# Altium schematic sheet SCH9_BBB_Eth.SchDoc: Beaglebone Black - Ethernet
size B; Organization: CWRUbotix; Address1: 10900 Euclid Avenue; Address2: Cleveland, OH 44106; Address3: USA; Revision: 1.0; SheetNumber: 9; SheetTotal: 13
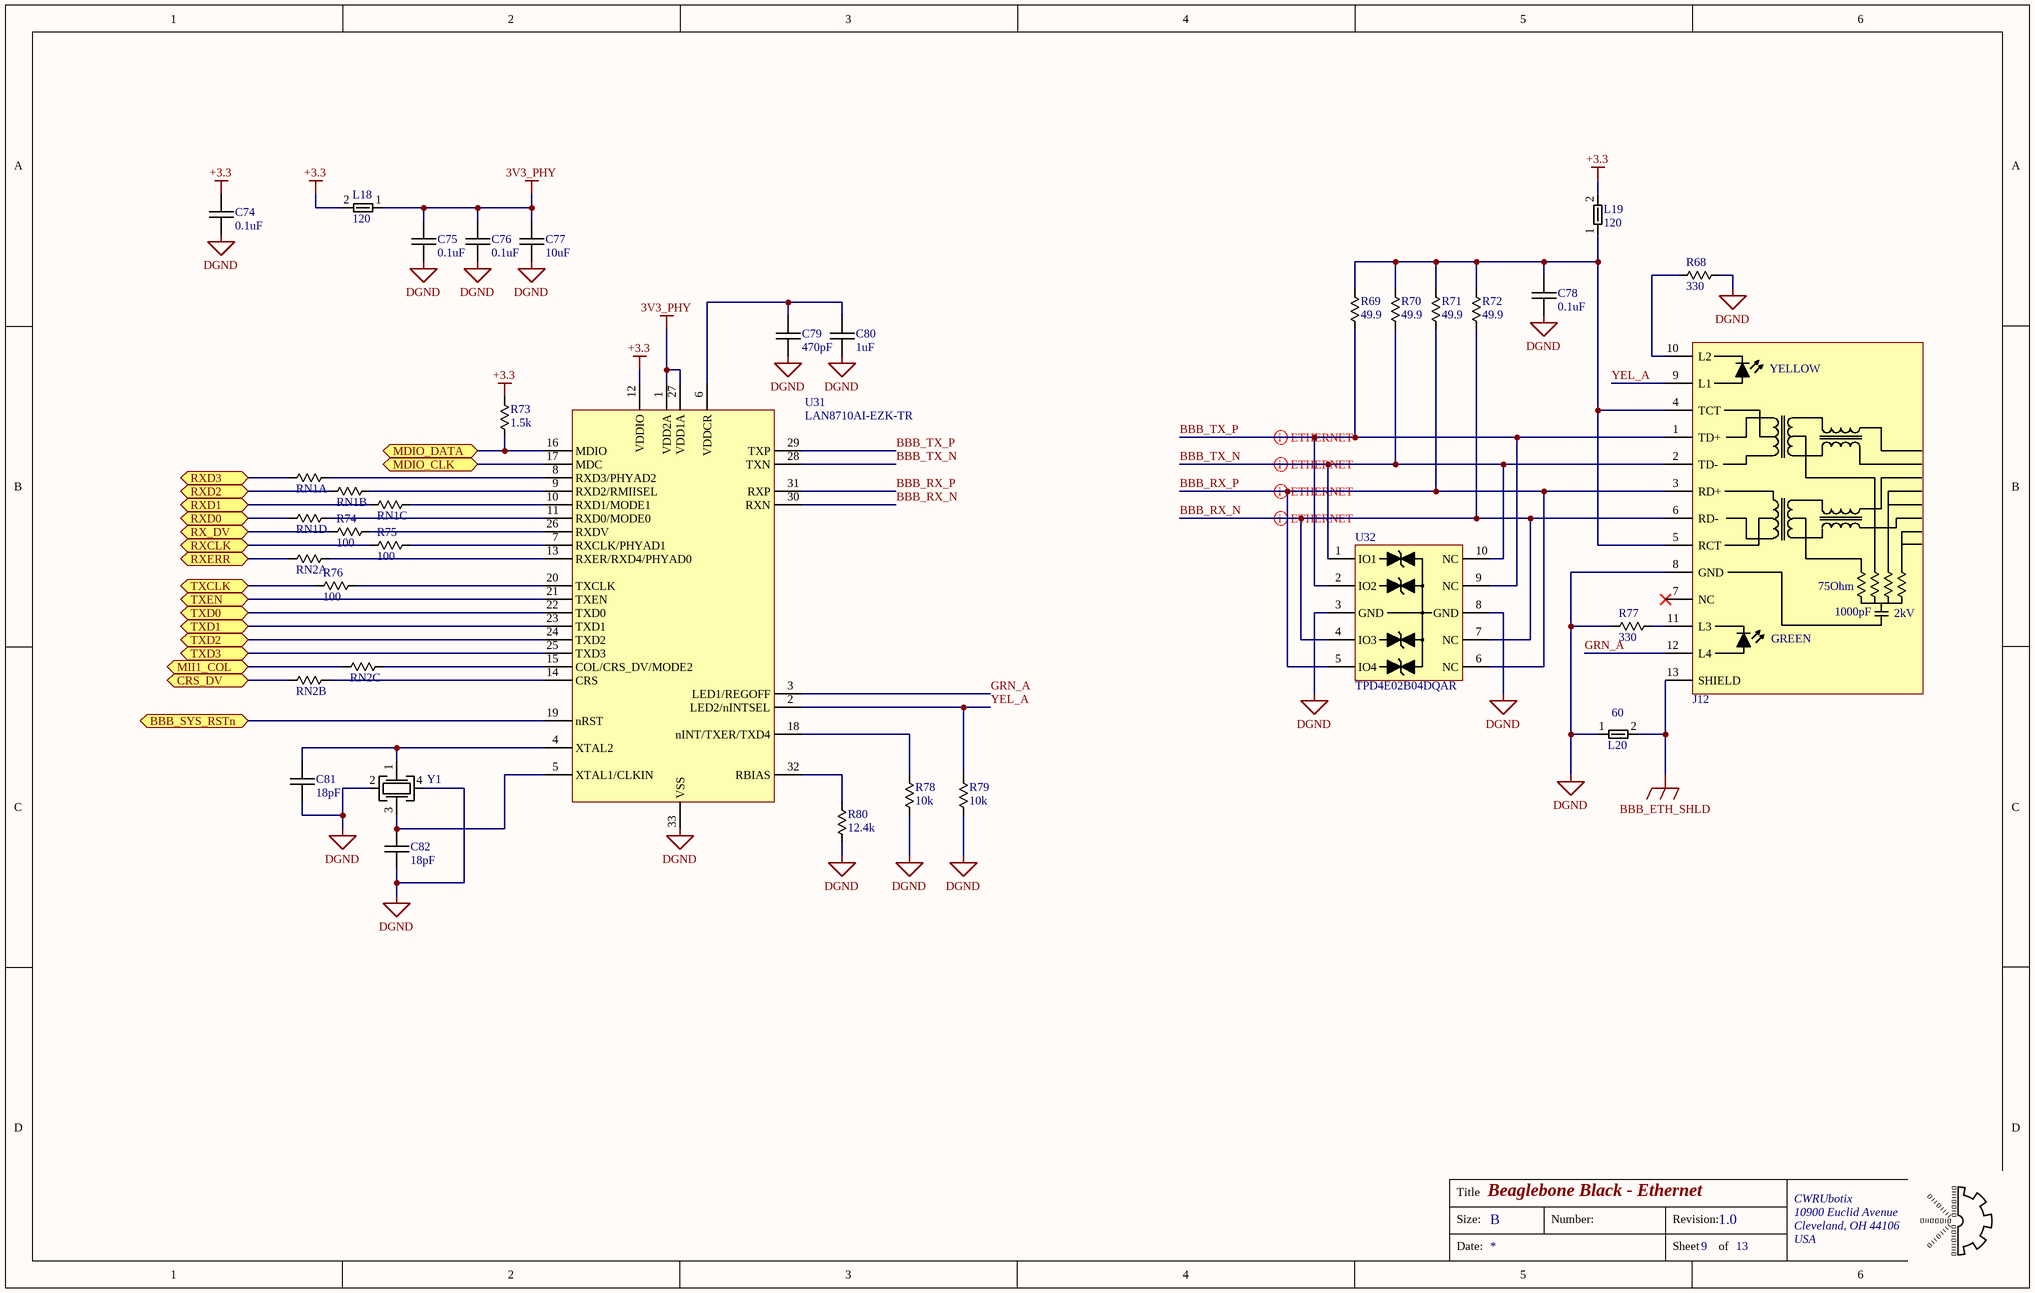
[diagram p0: SCH9_BBB_Eth.SchDoc]

## Parts
C74  0.1uF  [chip_0603]
C75  0.1uF  [chip_0603]
C76  0.1uF  [chip_0603]
C77  10uF  [chip_1206]
C78  0.1uF  [chip_0603]
C79  470pF  [chip_0603]
C80  1uF  [chip_0805]
C81  18pF  [chip_0603]
C82  18pF  [chip_0603]
J12  amphenol-RJMG1B  [AMPHENOL_RJMG1B]  (value not drawn)
L18  Impedance: 120  [CHIP_0603_FE]  (hidden comment: bead_0)
L19  Impedance: 120  [CHIP_0603_FE]  (hidden comment: bead_0)
L20  Impedance: 60  [CHIP_0805_FE]  (hidden comment: bead_0)
R68  330  [chip_0603]
R69  49.9  [chip_0603]
R70  49.9  [chip_0603]
R71  49.9  [chip_0603]
R72  49.9  [chip_0603]
R73  1.5k  [chip_0603]
R74  100  [chip_0603]
R75  100  [chip_0603]
R76  100  [chip_0603]
R77  330  [chip_0603]
R78  10k  [chip_0603]
R79  10k  [chip_0603]
R80  12.4k  [chip_0603]
RN1  res_array_4  [chip_1206_arr]  (value not drawn)  (parts A,B,C,D of 4)
RN2  res_array_4  [chip_1206_arr]  (value not drawn)  (parts A,B,C of 4)
U31  LAN8710AI-EZK-TR  [QFN-32-EP]
U32  TPD4E02B04DQAR  [USON-10]
Y1  osc_xtal_4p_1-3  [ECX-32]  (value not drawn)

## Ports
BBB_SYS_RSTn (bidir), CRS_DV (bidir), MDIO_CLK (bidir), MDIO_DATA (bidir), MII1_COL (bidir), RX_DV (bidir), RXCLK (bidir), RXD0 (bidir), RXD1 (bidir), RXD2 (bidir), RXD3 (bidir), RXERR (bidir), TXCLK (bidir), TXD0 (bidir), TXD1 (bidir), TXD2 (bidir), TXD3 (bidir), TXEN (bidir)

## Nets
3V3_PHY: C75.2 C76.2 C77.1 L18.1 U31.1(VDD2A) U31.27(VDD1A)
+3.3: C74.2 L18.2 L19.2 R73.1 U31.12(VDDIO)
BBB_ETH_SHLD: J12.13(SHIELD) L20.2
DGND: C74.1 C75.1 C76.1 C77.2 C78.1 C79.2 C80.2 C81.2 C82.2 J12.8(GND) L20.1 R68.1 R77.2 R78.2 R79.2 R80.2 U31.33(VSS) U32.3(GND) U32.8(GND) Y1.2(GND) Y1.4(GND)
BBB_RX_N: J12.6(RD-) R72.2 U31.30(RXN) U32.4(IO3) U32.7(NC)
BBB_RX_P: J12.3(RD+) R71.2 U31.31(RXP) U32.5(IO4) U32.6(NC)
BBB_SYS_RSTn: U31.19(nRST) ; port BBB_SYS_RSTn
BBB_TX_N: J12.2(TD-) R70.2 U31.28(TXN) U32.1(IO1) U32.10(NC)
BBB_TX_P: J12.1(TD+) R69.2 U31.29(TXP) U32.2(IO2) U32.9(NC)
CRS_DV: RN2.2 ; port CRS_DV
GRN_A: J12.12(L4) U31.3(LED1/REGOFF)
MDIO_CLK: U31.17(MDC) ; port MDIO_CLK
MDIO_DATA: R73.2 U31.16(MDIO) ; port MDIO_DATA
MII1_COL: RN2.3 ; port MII1_COL
RX_DV: R74.1 ; port RX_DV
RXCLK: R75.1 ; port RXCLK
RXD0: RN1.4 ; port RXD0
RXD1: RN1.3 ; port RXD1
RXD2: RN1.2 ; port RXD2
RXD3: RN1.1 ; port RXD3
RXERR: RN2.1 ; port RXERR
TXCLK: R76.1 ; port TXCLK
TXD0: U31.22(TXD0) ; port TXD0
TXD1: U31.23(TXD1) ; port TXD1
TXD2: U31.24(TXD2) ; port TXD2
TXD3: U31.25(TXD3) ; port TXD3
TXEN: U31.21(TXEN) ; port TXEN
YEL_A: J12.9(L1) R79.1 U31.2(LED2/nINTSEL)
NetC78_2: C78.2 J12.4(TCT) J12.5(RCT) L19.1 R69.1 R70.1 R71.1 R72.1
NetC79_1: C79.1 C80.1 U31.6(VDDCR)
NetC81_1: C81.1 U31.4(XTAL2) Y1.1
NetC82_1: C82.1 U31.5(XTAL1/CLKIN) Y1.3
NetJ12_10: J12.10(L2) R68.2
NetJ12_11: J12.11(L3) R77.1
NetR74_2: R74.2 U31.26(RXDV)
NetR75_2: R75.2 U31.7(RXCLK/PHYAD1)
NetR76_2: R76.2 U31.20(TXCLK)
NetR78_1: R78.1 U31.18(nINT/TXER/TXD4)
NetR80_1: R80.1 U31.32(RBIAS)
NetRN1_5: RN1.5 U31.11(RXD0/MODE0)
NetRN1_6: RN1.6 U31.10(RXD1/MODE1)
NetRN1_7: RN1.7 U31.9(RXD2/RMIISEL)
NetRN1_8: RN1.8 U31.8(RXD3/PHYAD2)
NetRN2_6: RN2.6 U31.15(COL/CRS_DV/MODE2)
NetRN2_7: RN2.7 U31.14(CRS)
NetRN2_8: RN2.8 U31.13(RXER/RXD4/PHYAD0)

Not connected (* = marked no-connect by the designer): J12 7(NC)*

## Layout directives
differential pair: BBB_RX_N, BBB_RX_P, BBB_TX_N, BBB_TX_P

## Notes on the sheet
- Title
- Size:
- B
- Number:
- Revision:
- Date:
- Sheet
- of
- (in symbol CONN-00057) YELLOW; 75Ohm; 1000pF; 2kV; GREEN

## Library data of the parts
C74-C76 C78 = CAP-00542: CAP, 0.1uF, ±10%, 16V, X7R, 0603; Manufacturer: Murata; Part Number: CAP-00542; Capacitance: 0.1uF; Tolerance: ±10%; Voltage Rating: 16V; Type: X7R
C77 = CAP-00539: CAP, 10uF, ±10%, 25V, X7R, 1206; Manufacturer: Samsung; Manufacturer PN: CL31B106KAHNNNE; Part Number: CAP-00539; Capacitance: 10uF; Tolerance: ±10%; Voltage Rating: 25V; Type: X7R
C79 = CAP-00429: CAP, 470pF, ±2%, 50V, C0G, 0603; Manufacturer: Murata; Manufacturer PN: GRM1885C1H471GA01D; Part Number: CAP-00429; Capacitance: 470pF; Tolerance: ±2%; Voltage Rating: 50V; Type: C0G
C80 = CAP-00110: CAP, 1uF, 10%, 16V, X7R, 0805; Manufacturer: Murata; Manufacturer PN: GRM21BR71C105KA01K; Part Number: CAP-00110; Capacitance: 1uF; Tolerance: 10%; Voltage Rating: 16V; Type: X7R
C81 C82 = CAP-00409: CAP, 18pF, ±2%, 50V, C0G, 0603; Manufacturer: Murata; Manufacturer PN: GRM1885C1H180GA01D; Part Number: CAP-00409; Capacitance: 18pF; Tolerance: ±2%; Voltage Rating: 50V; Type: C0G
J12 = CONN-00057: RJ45 Modular Mag-Jack, 8P8C, 10/100 Base-T; Manufacturer PN: RJMG1BD3B8K1ANR; Part Number: CONN-00057; Type: Jack; Manufacturer: Amphenol; Cost: 3.92
L18 L19 = MAG-00126: Fe Bead, 120 @ 100MHz, 800mA, 0603; Manufacturer: Murata; Manufacturer PN: BLM18AG121SN1D; DCR: 180mOhm; Part Number: MAG-00126; Current Rating: 800mA; Test Freq: 100MHz; Cost: 0.1
L20 = MAG-00125: Fe Bead, 60 @ 100MH, 3A, 0805; Manufacturer: Pulse Electronics; Manufacturer PN: PE-0805PFB600ST; Test Freq: 100MHz; DCR: 25mOhm; Part Number: MAG-00125; Current Rating: 3A; Cost: 0.1
R68 R77 = RES-00221: RES SMD 330 OHM 1% 1/4W 0603; Manufacturer: Panasonic; Manufacturer PN: ERJ-PA3F3300V; Power Rating: 0.25W; Part Number: RES-00221; Resistance: 330; Tolerance: 1%
R69-R72 = RES-00705: RES SMD 49.9 OHM 1% 1/10W 0603; Manufacturer: Yageo; Manufacturer PN: RC0603FR-0749R9L; Part Number: RES-00705; Resistance: 49.9; Tolerance: 1%; Power Rating: 1/10W; Cost: 0.1
R73 = RES-00284: RES SMD 1.5K OHM 1% 1/4W 0603; Manufacturer: Panasonic; Manufacturer PN: ERJ-PA3F1501V; Power Rating: 0.25W; Part Number: RES-00284; Resistance: 1.5k; Tolerance: 1%
R74-R76 = RES-00178: RES SMD 100 OHM 1% 1/4W 0603; Manufacturer: Panasonic; Manufacturer PN: ERJ-PA3F1000V; Power Rating: 0.25W; Part Number: RES-00178; Resistance: 100; Tolerance: 1%
R78 R79 = RES-00306: RES SMD 10K OHM 1% 1/4W 0603; Manufacturer: Panasonic; Manufacturer PN: ERJ-PA3F1002V; Power Rating: 0.25W; Part Number: RES-00306; Resistance: 10k; Tolerance: 1%; Cost: 0.144
R80 = RES-00721: RES SMD 12.4K OHM 1% 1/10W 0603; Manufacturer: Stackpole; Manufacturer PN: RMCF0603FT12K4; Part Number: RES-00721; Resistance: 12.4k; Tolerance: 1%; Power Rating: 1/10W; Cost: 0.1
RN1 RN2 = RES-00723: RES ARRAY 4 RES 100 OHM 5% 62.5mW 1206; Manufacturer: Panasonic; Manufacturer PN: EXB-38V101JV; Resistance: 100; Power Rating: 1/16W; Part Number: RES-00723; Tolerance: 5%; Cost: 0.1
U31 = IFACE-00025: IC, 10/100 Ethernet Transceiver; Manufacturer: Microchip; Part Number: IFACE-00025; Manufacturer PN: LAN8710AI-EZK-TR; Cost: 1.56
U32 = DIO-00068: TVS, 4-Ch, ESD Protec, 3.6V 8.8V 10-USON; Manufacturer: TI; Power Rating: 17W; Current Rating: 2A; Part Number: DIO-00068; Type: TVS; Manufacturer PN: TPD4E02B04DQAR; Cost: 0.56
Y1 = OSC-00005: XTAL, 25MHz, 20pF, 20ppm; Manufacturer: ECS Inc.; Manufacturer PN: ECS-250-20-33-JTN-TR; Frequency: 25M; ESR: 40; Part Number: OSC-00005; Load Capacitance: 20pF; Stability: 20ppm; Tolerance: 20ppm; Cost: 0.56